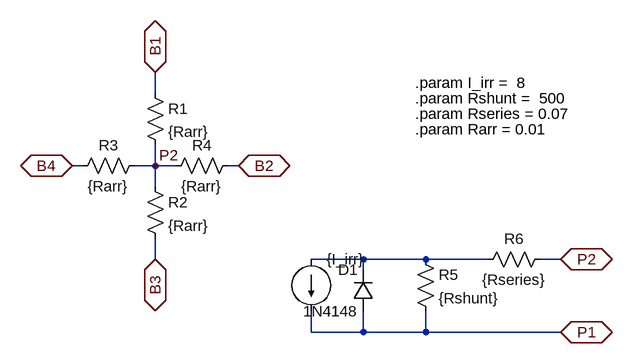
[diagram p0: schematic PV_Motif.asc]
PV_Motif.asc, the LTspice schematic file:
Version 4
SHEET 1 2152 2064
WIRE -1936 400 -1936 368
WIRE -2048 512 -2064 512
WIRE -1936 512 -1936 480
WIRE -1936 512 -1968 512
WIRE -1904 512 -1936 512
WIRE -1808 512 -1824 512
WIRE -1936 544 -1936 512
WIRE -1936 656 -1936 624
WIRE -1616 656 -1696 656
WIRE -1520 656 -1616 656
WIRE -1424 656 -1520 656
WIRE -1312 656 -1344 656
WIRE -1616 672 -1616 656
WIRE -1696 768 -1696 736
WIRE -1616 768 -1616 736
WIRE -1616 768 -1696 768
WIRE -1520 768 -1520 736
WIRE -1520 768 -1616 768
WIRE -1312 768 -1520 768
FLAG -1936 368 B1
IOPIN -1936 368 BiDir
FLAG -1808 512 B2
IOPIN -1808 512 BiDir
FLAG -1936 656 B3
IOPIN -1936 656 BiDir
FLAG -2064 512 B4
IOPIN -2064 512 BiDir
FLAG -1312 768 P1
IOPIN -1312 768 BiDir
FLAG -1936 512 P2
FLAG -1312 656 P2
IOPIN -1312 656 BiDir
SYMBOL res -1952 384 R0
SYMATTR InstName R1
SYMATTR Value {Rarr}
SYMBOL res -1952 528 R0
SYMATTR InstName R2
SYMATTR Value {Rarr}
SYMBOL res -1952 496 R90
WINDOW 0 0 56 VBottom 2
WINDOW 3 32 56 VTop 2
SYMATTR InstName R3
SYMATTR Value {Rarr}
SYMBOL res -1808 496 R90
WINDOW 0 0 56 VBottom 2
WINDOW 3 32 56 VTop 2
SYMATTR InstName R4
SYMATTR Value {Rarr}
SYMBOL diode -1600 736 R180
WINDOW 0 24 64 Left 2
WINDOW 3 24 0 Left 2
SYMATTR InstName D1
SYMATTR Value 1N4148
SYMBOL current -1696 656 R0
WINDOW 0 24 80 Left 2
WINDOW 3 24 0 Left 2
WINDOW 123 0 0 Left 0
WINDOW 39 0 0 Left 0
SYMATTR InstName I1
SYMATTR Value {I_irr}
SYMBOL res -1536 640 R0
SYMATTR InstName R5
SYMATTR Value {Rshunt}
SYMBOL res -1328 640 R90
WINDOW 0 0 56 VBottom 2
WINDOW 3 32 56 VTop 2
SYMATTR InstName R6
SYMATTR Value {Rseries}
TEXT -1536 384 Left 2 !.param I_irr =  8
TEXT -1536 408 Left 2 !.param Rshunt =  500
TEXT -1536 432 Left 2 !.param Rseries = 0.07
TEXT -1536 456 Left 2 !.param Rarr = 0.01

The netlist it stands for:
* PV_Motif.asc
R1 B1 P2 {Rarr}
R2 P2 B3 {Rarr}
R3 P2 B4 {Rarr}
R4 B2 P2 {Rarr}
D1 P1 N001 1N4148
I1 N001 P1 {I_irr}
R5 N001 P1 {Rshunt}
R6 P2 N001 {Rseries}
.model D D
.lib standard.dio
.param I_irr =  8
.param Rshunt =  500
.param Rseries = 0.07
.param Rarr = 0.01
.backanno
.end